# Altium schematic sheet Sheet1.SchDoc
size A4
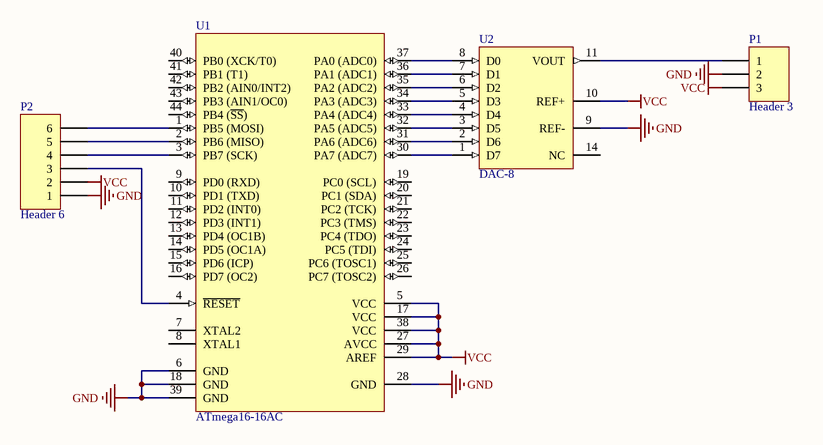
[diagram p0: Sheet1.SchDoc]

## Parts
P1  Header 3  [HDR1X3]
P2  Header 6  [HDR1X6]
U1  ATmega16-16AC  [44A_N]
U2  DAC-8  [SOT402-1_N]

## Nets
GND: P1.2 P2.1 U1.6(GND) U1.18(GND) U1.28(GND) U1.39(GND) U2.9(REF-) U2.12(GND)
VCC: P1.3 P2.2 U1.5(VCC) U1.17(VCC) U1.27(AVCC) U1.29(AREF) U1.38(VCC) U2.10(REF+) U2.13(VCC)
NetP1_1: P1.1 U2.11(VOUT)
NetP2_3: P2.3 U1.4(~{RESET})
NetP2_4: P2.4 U1.3(PB7_(SCK))
NetP2_5: P2.5 U1.2(PB6_(MISO))
NetP2_6: P2.6 U1.1(PB5_(MOSI))
NetU1_30: U1.30(PA7_(ADC7)) U2.1(D7)
NetU1_31: U1.31(PA6_(ADC6)) U2.2(D6)
NetU1_32: U1.32(PA5_(ADC5)) U2.3(D5)
NetU1_33: U1.33(PA4_(ADC4)) U2.4(D4)
NetU1_34: U1.34(PA3_(ADC3)) U2.5(D3)
NetU1_35: U1.35(PA2_(ADC2)) U2.6(D2)
NetU1_36: U1.36(PA1_(ADC1)) U2.7(D1)
NetU1_37: U1.37(PA0_(ADC0)) U2.8(D0)

Not connected (* = marked no-connect by the designer): U1 7(XTAL2) 8(XTAL1) 9(PD0_(RXD)) 10(PD1_(TXD)) 11(PD2_(INT0)) 12(PD3_(INT1)) 13(PD4_(OC1B)) 14(PD5_(OC1A)) 15(PD6_(ICP)) 16(PD7_(OC2)) 19(PC0_(SCL)) 20(PC1_(SDA)) 21(PC2_(TCK)) 22(PC3_(TMS)) 23(PC4_(TDO)) 24(PC5_(TDI)) 25(PC6_(TOSC1)) 26(PC7_(TOSC2)) 40(PB0_(XCK/T0)) 41(PB1_(T1)) 42(PB2_(AIN0/INT2)) 43(PB3_(AIN1/OC0)) 44(PB4_(~{SS})); U2 14(NC)

## Library data of the parts
P1 = Header 3: Header, 3-Pin; LatestRevisionDate: 17-Jul-2002; LatestRevisionNote: Re-released for DXP Platform.; Publisher: Altium Limited
P2 = Header 6: Header, 6-Pin; LatestRevisionDate: 17-Jul-2002; LatestRevisionNote: Re-released for DXP Platform.; Publisher: Altium Limited
U1 = ATmega16-16AC: 8-Bit AVR Microcontroller with 16K Bytes of In-System Programmable Flash Memory; Published: 17-Sep-2003; LatestRevisionDate: 13-Apr-2006; LatestRevisionNote: IPC-7351 Footprint Added.; DatasheetVersion: 2466E-AVR-10/02; PackageVersion: rev.B, Oct-2001; PackageReference: 44A; Publisher: Altium Limited; PackageDescription: 44-Pin Thin Quad Flat Pack 0.8 mm Pitch; ComponentLink1Description: Manufacturer Link; ComponentLink1URL: http://www.atmel.com; ComponentLink2Description: Datasheet; ComponentLink2URL: http://www.atmel.com/dyn/resources/prod_documents/doc2466.pdf
U2 = DAC-8: Generic 8-Bit D/A Converter; Published: 8-Jun-2000; LatestRevisionDate: 29-May-2009; LatestRevisionNote: IPC-7351 Footprint Added.; PackageVersion: Mar-2002; PackageReference: SOT402-1; Publisher: Altium Limited; PackageDescription: 14-Pin Thin Small Outline Package 0.65 mm Pitch; Code_JEDEC: MO-153